# EAGLE design receiver_schematic (EAGLE 9.1.3)
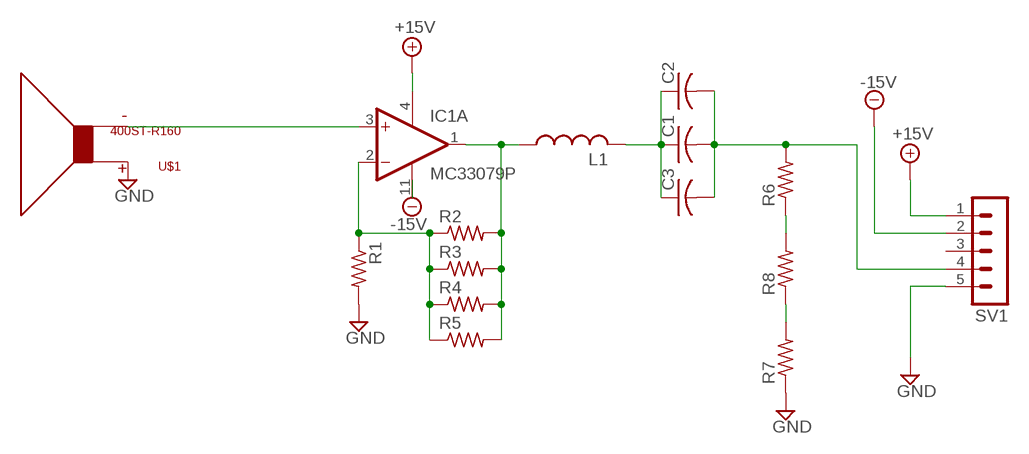
[diagram p0: schematic, sheet 1]

## Parts
C1  C-US025-030X050  [C025-030X050]
C2  C-US025-030X050  [C025-030X050]
C3  C-US025-030X050  [C025-030X050]
IC1  MC33079P  [DIL14]
L1  L-US0204/5  [0204/5]
R1  R-US_0204/5  [0204/5]
R2  R-US_0204/5  [0204/5]
R3  R-US_0204/5  [0204/5]
R4  R-US_0204/5  [0204/5]
R5  R-US_0204/5  [0204/5]
R6  R-US_0204/5  [0204/5]
R7  R-US_0204/5  [0204/5]
R8  R-US_0204/5  [0204/5]
SV1  MA05-1  [MA05-1]
U$1  400ST-R160  [400STR160]

## Nets
+15V: IC1.4(P:V+) SV1.1
-15V: IC1.11(P:V-) SV1.2
GND: R1.2 R7.1 SV1.5 U$1.P$1
N$1: IC1.3(A:+IN) U$1.P$2
N$2: C1.1 C2.1 C3.1 L1.2
N$3: IC1.1(A:OUT) L1.1 R2.2 R3.2 R4.2 R5.2
N$4: IC1.2(A:-IN) R1.1 R2.1 R3.1 R4.1 R5.1
N$5: C1.2 C2.2 C3.2 R6.2 SV1.4
N$6: R6.1 R8.2
N$7: R7.2 R8.1
Unconnected: IC1.5(B:+IN) IC1.6(B:-IN) IC1.7(B:OUT) IC1.8(C:OUT) IC1.9(C:-IN) IC1.10(C:+IN) IC1.12(D:+IN) IC1.13(D:-IN) IC1.14(D:OUT) SV1.3

## Library data of the parts
C1-C3 = rcl:C-US: CAPACITOR, American symbol; SPICEPREFIX: C
IC1 = linear3:MC33079: OP AMP
L1 = rcl:L-US: INDUCTOR, American symbol; SPICEPREFIX: L
R1-R8 = rcl:R-US_: RESISTOR, American symbol; SPICEPREFIX: R
SV1 = con-lstb:MA05-1: PIN HEADER; OC_FARNELL: unknown; OC_NEWARK: unknown
U$1 = ultrasonic_transducer-1:400ST-R160

## Board
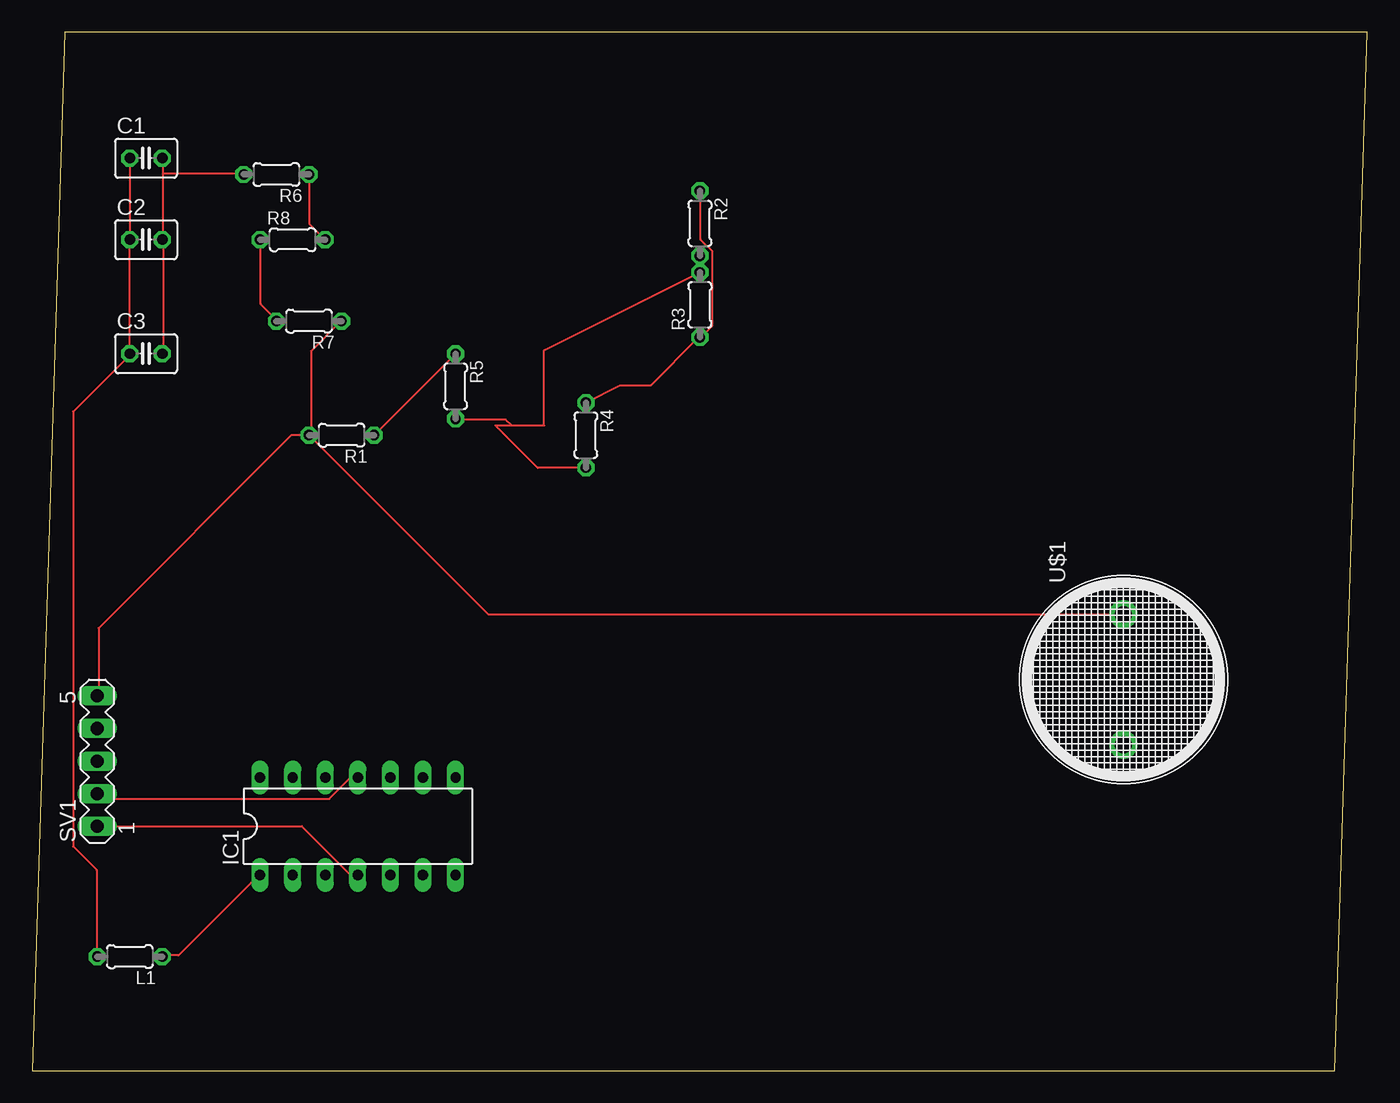
[diagram p1: board, top side]
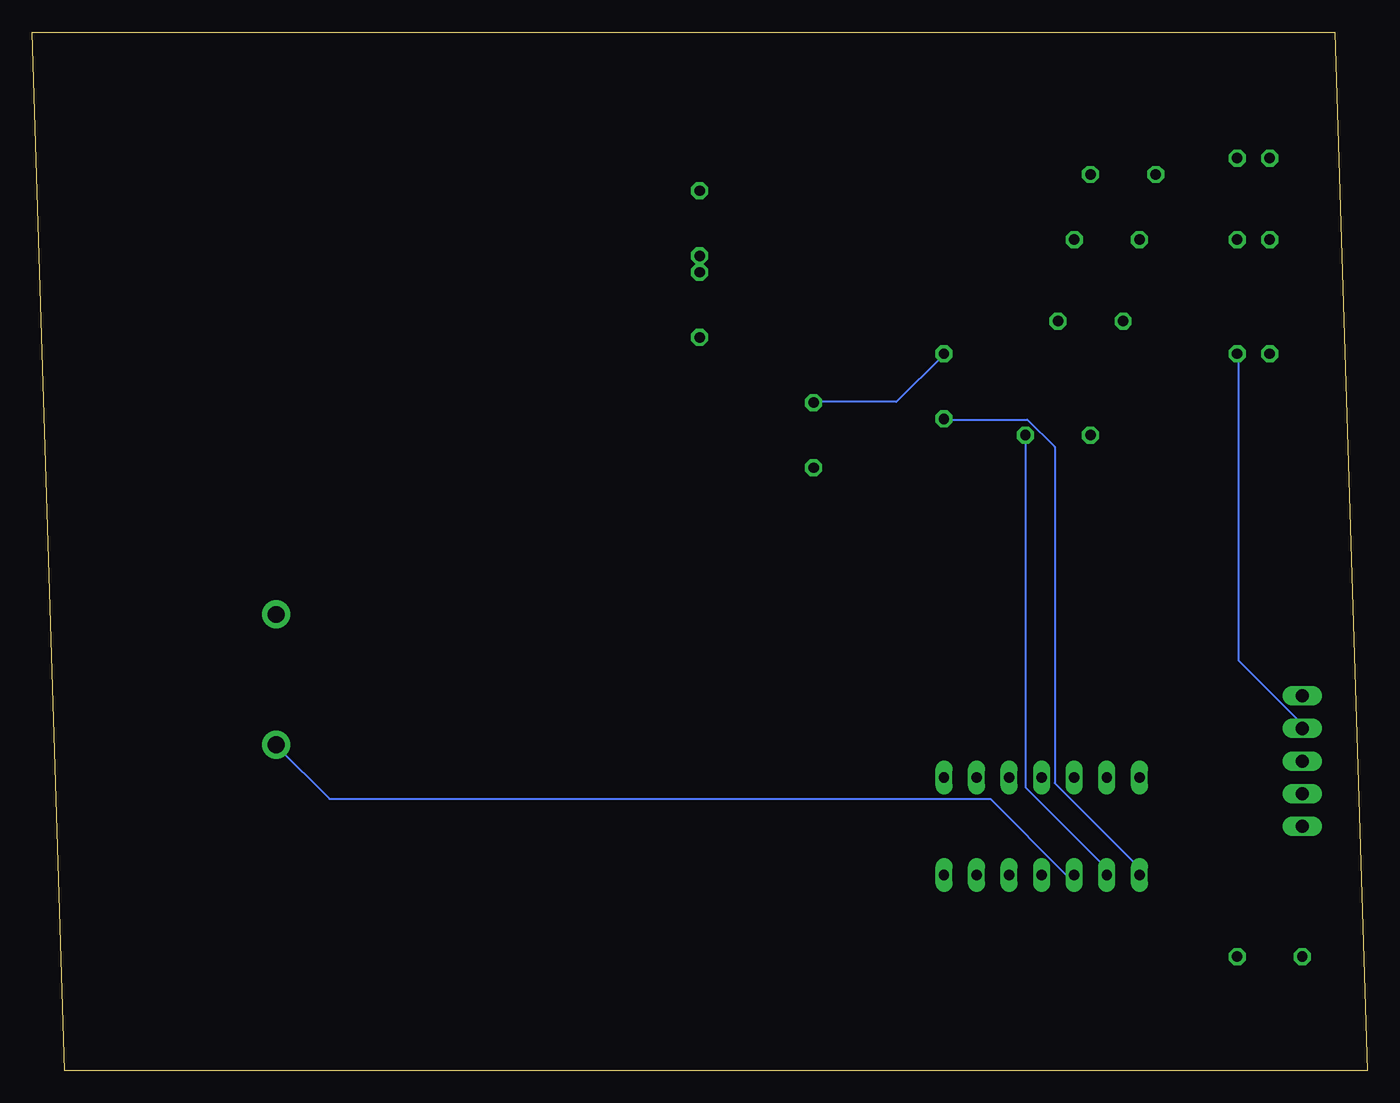
[diagram p2: board, bottom side, seen from below]

Size 104.12 x 80.95 mm. Coordinates in mm from the lower left corner, seen from the top.
Outline: 0,0 101.58,0 104.12,80.95 2.54,80.95 0,0
Copper layers (1*16): Top 1mm / dielectric 1.5mm / Bottom 0.035mm
Design rules "default *": minimum track width 6mil, minimum drill 0.35mm, track to track 10mil, track to pad 10mil, pad to pad 10mil, via to via 10mil, smd to smd 10mil, copper to edge 40mil, drill to drill 6mil, minimum pad ring 10mil, minimum via ring 10mil, stop-mask expansion 4mil, vias tented up to drill 0mil, thermal gap 10mil

### Footprints (pad centres in the part's own frame; a part is rotated, then mirrored left to right if it is on the bottom)
C025-030X050 = drill 0.813 octagon: 1 -1.27,0; 2 1.27,0
DIL14 = drill 0.813 long: 1 -7.62,-3.81; 2 -5.08,-3.81; 3 -2.54,-3.81; 4 0,-3.81; 5 2.54,-3.81; 6 5.08,-3.81; 7 7.62,-3.81; 8 7.62,3.81; 9 5.08,3.81; 10 2.54,3.81; 11 0,3.81; 12 -2.54,3.81; 13 -5.08,3.81; 14 -7.62,3.81
0204/5 = drill 0.813 octagon: 1 -2.54,0; 2 2.54,0
MA05-1 = drill 1.016 long: 1 -5.08,0; 2 -2.54,0; 3 0,0; 4 2.54,0; 5 5.08,0
400STR160 = drill 1.3 pad 2.184: P$1 5.08,0; P$2 -5.08,0

### Placement (x,y rotation side)
C1  8.89,71.12 0 top
C2  8.89,64.77 0 top
C3  8.89,55.88 0 top
IC1  25.4,19.05 0 top
L1  7.62,8.89 180 top
R1  24.13,49.53 180 top
R2  52.07,66.04 270 top
R3  52.07,59.69 90 top
R4  43.18,49.53 270 top
R5  33.02,53.34 270 top
R6  19.05,69.85 180 top
R7  21.59,58.42 180 top
R8  20.32,64.77 0 top
SV1  5.08,24.13 90 top
U$1  85.09,30.48 90 top

### Tracks (layer width: path | path; a pad name or v marks a point on that pad's centre or on a via)
+15V
  Top 0.152: IC1.4 25.3,15.24 24.84,15.24 21.03,19.05 5.18,19.05 SV1.1
-15V
  Top 0.152: IC1.11 25.3,22.86 24.84,22.86 23.16,21.18 5.49,21.18 5.18,21.49 SV1.2
GND
  Top 0.152: SV1.5 5.18,29.26 5.18,34.49 20.22,49.53 21.49,49.53 21.54,49.58 R1.2 | R1.2 21.74,49.58 21.74,56.08 23.98,58.32 R7.1 | U$1.P$1 84.94,35.56 35.56,35.56 21.74,49.38 R1.2
N$1
  Bottom 0.152: IC1.3 23.47,15.24 29.41,21.18 80.92,21.18 85.04,25.3 U$1.P$2
N$2
  Top 0.152: C1.1 7.62,71.02 C2.1 7.62,55.93 C3.1 7.62,55.78 3.2,51.36 3.2,17.48 5.03,15.65 5.03,8.99 L1.2
N$3
  Top 0.152: L1.1 10.21,8.99 11.43,8.99 17.68,15.24 IC1.1 | R2.2 52.12,63.4 52.12,62.33 R3.2 39.93,56.16 39.93,50.29 37.39,50.29 | 37.39,50.29 36.93,50.75 33.07,50.75 R5.2 | R4.2 39.42,46.99 36.12,50.29 37.39,50.29
  Bottom 0.152: IC1.1 17.83,15.24 17.83,15.85 24.38,22.4 24.38,48.62 26.52,50.75 32.92,50.75 R5.2
N$4
  Top 0.152: R4.1 45.82,53.39 48.21,53.39 51.97,57.15 R3.1 52.12,57.15 53.03,58.06 53.03,63.86 52.12,64.77 52.12,68.58 R2.1 | R1.1 32.92,55.78 R5.1
  Bottom 0.152: R1.1 26.67,22.1 20.42,15.85 20.42,15.24 IC1.2 | R4.1 43.13,52.12 36.73,52.12 33.07,55.78 R5.1
N$5
  Top 0.152: 10.21,64.77 10.21,55.93 C3.2 | 10.21,64.77 C2.2 10.21,64.77 | 10.21,64.77 10.21,69.95 | 10.21,69.95 10.21,71.02 C1.2 | 10.21,69.95 16.46,69.95 R6.2
  Bottom 0.152: SV1.4 5.18,26.67 5.18,27.13 10.06,32 10.06,55.78 C3.2
N$6
  Top 0.152: R8.2 21.64,65.99 21.64,69.8 R6.1
N$7
  Top 0.152: R8.1 17.83,64.77 17.83,59.74 19.05,58.52 R7.2